# EAGLE design Risha (EAGLE 6.1)
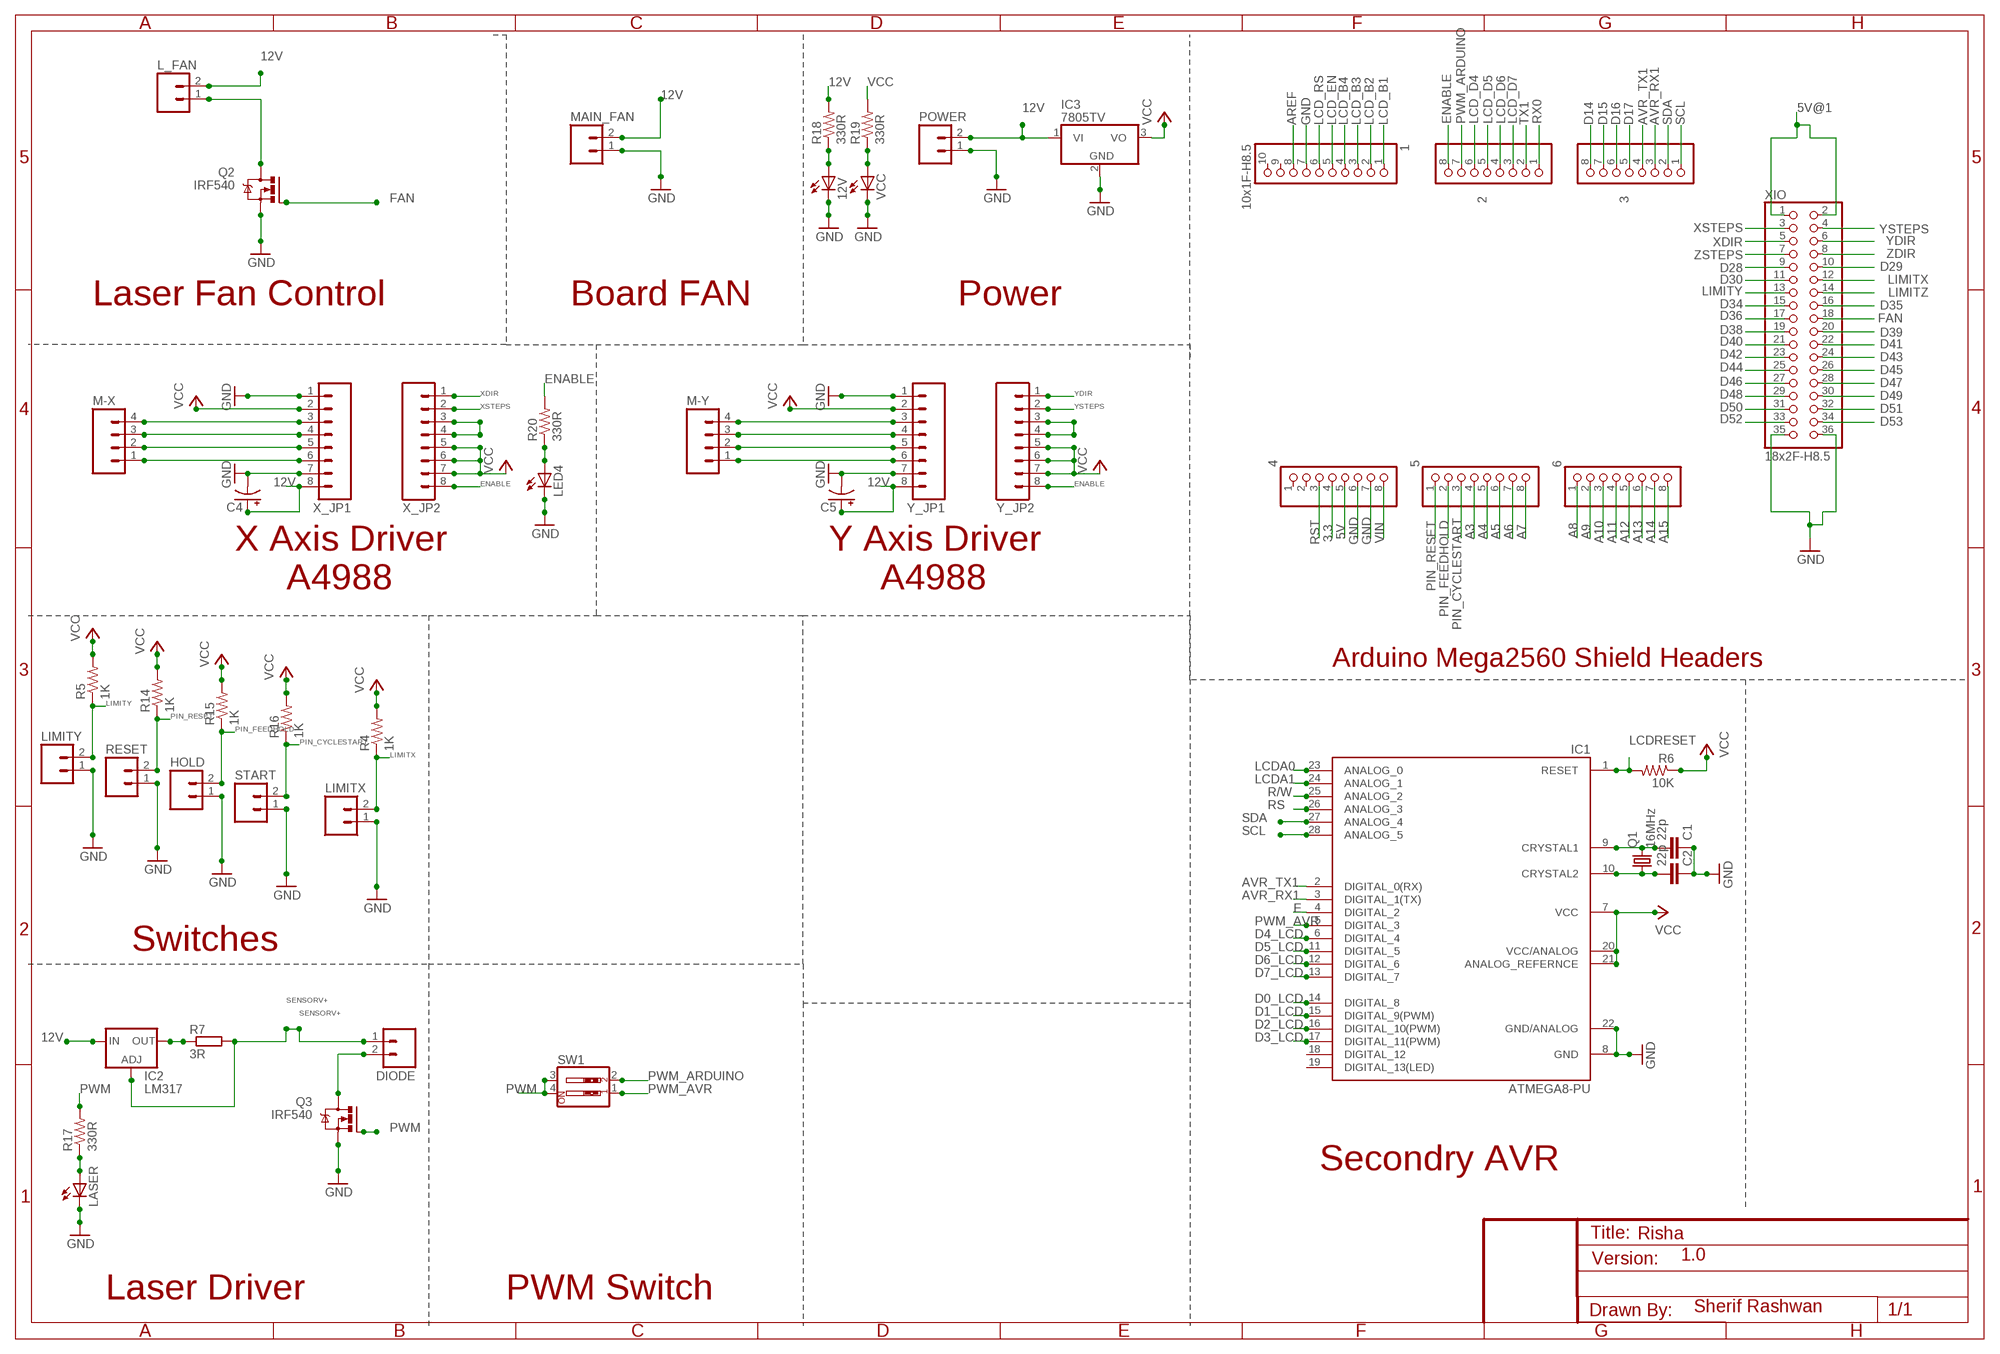
[diagram p0: schematic, sheet 1]

## Parts
1  10x1F-H8.5  PINHD-1X10_ARD  [1X10]
2  8x1F-H8.5  PINHD-1X8  [1X08]
3  8x1F-H8.5  PINHD-1X8  [1X08]
4  8x1F-H8.5  PINHD-1X8  [1X08]
5  8x1F-H8.5  PINHD-1X8  [1X08]
6  8x1F-H8.5  PINHD-1X8  [1X08]
12V  LED3MM  [LED3MM]
C1  22p  C2.5/2  [C2.5-2]
C2  22p  C2.5/2  [C2.5-2]
C4  CAP_POLPTH2  [CPOL-RADIAL-10UF-25V]
C5  CAP_POLPTH2  [CPOL-RADIAL-10UF-25V]
DIODE  M02PTH  [1X02]
HOLD  M02PTH  [1X02]
IC1  ATMEGA8-PU  [DIL28-3]
IC2  LM317  LM317-TO3  [TO3-K02]
IC3  7805TV  [TO220V]
L_FAN  M02PTH  [1X02]
LASER  LED3MM  [LED3MM]
LED4  LED3MM  [LED3MM]
LIMITX  M02PTH  [1X02]
LIMITY  M02PTH  [1X02]
M-X  M04PTH  [1X04]
M-Y  M04PTH  [1X04]
MAIN_FAN  M02PTH  [1X02]
POWER  M02PTH  [1X02]
Q1  16MHz  CRYSTALHC49US  [HC49US]
Q2  IRF540  [TO220BV]
Q3  IRF540  [TO220BV]
R4  1K  RESISTORPTH-1/6W  [1/6W-RES]
R5  1K  RESISTORPTH-1/6W  [1/6W-RES]
R6  10K  RESISTORPTH-1/6W  [1/6W-RES]
R7  3R  R-EU_0309/12  [0309/12]
R14  1K  RESISTORPTH-1/6W  [1/6W-RES]
R15  1K  RESISTORPTH-1/6W  [1/6W-RES]
R16  1K  RESISTORPTH-1/6W  [1/6W-RES]
R17  330R  RESISTORPTH-1/6W  [1/6W-RES]
R18  330R  RESISTORPTH-1/6W  [1/6W-RES]
R19  330R  RESISTORPTH-1/6W  [1/6W-RES]
R20  330R  RESISTORPTH-1/6W  [1/6W-RES]
RESET  M02PTH  [1X02]
START  M02PTH  [1X02]
SW1  SW_DIP-2  [EDG-02]
VCC  LED3MM  [LED3MM]
X_JP1  M08  [1X08]
X_JP2  M08  [1X08]
XIO  18x2F-H8.5  PINHD-2X18  [2X18]
Y_JP1  M08  [1X08]
Y_JP2  M08  [1X08]

## Nets
3.3: 4.4
5V: 4.5
5V@1: XIO.1 XIO.2
12V: C4.1(+) C5.1(+) IC2.1(IN) IC3.1(VI) L_FAN.2 MAIN_FAN.2 POWER.2 R18.2 X_JP1.8 Y_JP1.8
A3: 5.4
A4: 5.5
A5: 5.6
A6: 5.7
A7: 5.8
A8: 6.1
A9: 6.2
A10: 6.3
A11: 6.4
A12: 6.5
A13: 6.6
A14: 6.7
A15: 6.8
AREF: 1.8
AVR_RX1: 3.3 IC1.3(DIGITAL_1(TX))
AVR_TX1: 3.4 IC1.2(DIGITAL_0(RX))
D0_LCD: IC1.14(DIGITAL_8)
D1_LCD: IC1.15(DIGITAL_9(PWM))
D2_LCD: IC1.16(DIGITAL_10(PWM))
D3_LCD: IC1.17(DIGITAL_11(PWM))
D4_LCD: IC1.6(DIGITAL_4)
D5_LCD: IC1.11(DIGITAL_5)
D6_LCD: IC1.12(DIGITAL_6)
D7_LCD: IC1.13(DIGITAL_7)
D14: 3.8
D15: 3.7
D16: 3.6
D17: 3.5
D28: XIO.9
D29: XIO.10
D30: XIO.11
D34: XIO.15
D35: XIO.16
D36: XIO.17
D38: XIO.19
D39: XIO.20
D40: XIO.21
D41: XIO.22
D42: XIO.23
D43: XIO.24
D44: XIO.25
D45: XIO.26
D46: XIO.27
D47: XIO.28
D48: XIO.29
D49: XIO.30
D50: XIO.31
D51: XIO.32
D52: XIO.33
D53: XIO.34
E: IC1.4(DIGITAL_2)
ENABLE: 2.8 R20.2 X_JP2.8 Y_JP2.8
FAN: Q2.G XIO.18
GND: 1.7 4.6 4.7 12V.K(C) C1.1 C2.1 C4.2(-) C5.2(-) HOLD.1 IC1.8(GND) IC1.22(GND/ANALOG) IC3.2(GND) LASER.K(C) LED4.K(C) LIMITX.1 LIMITY.1 MAIN_FAN.1 POWER.1 Q2.S Q3.S RESET.1 START.1 VCC.K(C) X_JP1.1 X_JP1.7 XIO.35 XIO.36 Y_JP1.1 Y_JP1.7
LCD_B1: 1.1
LCD_B2: 1.2
LCD_B3: 1.3
LCD_B4: 1.4
LCD_D4: 2.6
LCD_D5: 2.5
LCD_D6: 2.4
LCD_D7: 2.3
LCD_EN: 1.5
LCD_RS: 1.6
LCDA0: IC1.23(ANALOG_0)
LCDA1: IC1.24(ANALOG_1)
LCDRESET: IC1.1(RESET) R6.2
LIMITX: LIMITX.2 R4.1 XIO.12
LIMITY: LIMITY.2 R5.1 XIO.13
LIMITZ: XIO.14
N$1: L_FAN.1 Q2.D
N$2: M-Y.4 Y_JP1.3
N$3: M-Y.3 Y_JP1.4
N$4: M-Y.2 Y_JP1.5
N$5: M-Y.1 Y_JP1.6
N$6: Y_JP2.3 Y_JP2.4
N$7: C1.2 IC1.9(CRYSTAL1) Q1.2
N$8: C2.2 IC1.10(CRYSTAL2) Q1.1
N$9: LASER.A R17.1
N$10: IC2.3(OUT) R7.1
N$11: DIODE.2 Q3.D
N$18: 12V.A R18.1
N$20: R19.1 VCC.A
N$21: LED4.A R20.1
N$28: M-X.4 X_JP1.3
N$29: M-X.3 X_JP1.4
N$30: M-X.2 X_JP1.5
N$31: M-X.1 X_JP1.6
N$35: X_JP2.3 X_JP2.4
PIN_CYCLESTART: 5.3 R16.1 START.2
PIN_FEEDHOLD: 5.2 HOLD.2 R15.1
PIN_RESET: 5.1 R14.1 RESET.2
PWM: Q3.G R17.2 SW1.3 SW1.4
PWM_ARDUINO: 2.7 SW1.2
PWM_AVR: IC1.5(DIGITAL_3) SW1.1
R/W: IC1.25(ANALOG_2)
RS: IC1.26(ANALOG_3)
RST: 4.3
RX0: 2.1
SCL: 3.1 IC1.28(ANALOG_5)
SDA: 3.2 IC1.27(ANALOG_4)
SENSORV+: DIODE.1 IC2.2(ADJ) R7.2
TX1: 2.2
VCC: IC1.7(VCC) IC1.20(VCC/ANALOG) IC1.21(ANALOG_REFERNCE) IC3.3(VO) R4.2 R5.2 R6.1 R14.2 R15.2 R16.2 R19.2 X_JP1.2 X_JP2.5 X_JP2.6 X_JP2.7 Y_JP1.2 Y_JP2.5 Y_JP2.6 Y_JP2.7
VIN: 4.8
XDIR: X_JP2.1 XIO.5
XSTEPS: X_JP2.2 XIO.3
YDIR: XIO.6 Y_JP2.1
YSTEPS: XIO.4 Y_JP2.2
ZDIR: XIO.8
ZSTEPS: XIO.7
Unconnected: 1.9 1.10 4.1 4.2 IC1.18(DIGITAL_12) IC1.19(DIGITAL_13(LED))

## Notes on the sheet
- Laser Fan Control | Board FAN | Power
- X Axis Driver | Y Axis Driver
- A4988 | A4988
- Arduino Mega2560 Shield Headers
- Switches
- Secondry AVR
- 1.0
- Laser Driver | PWM Switch
- Sherif Rashwan

## Library data of the parts
1 = SmartPrj:PINHD-1X10_ARD: PIN HEADER
2-6 = SmartPrj:PINHD-1X8: PIN HEADER
12V LASER LED4 VCC = 01_SparkFun:LED: LEDs Standard schematic elements and footprints for 5mm, 3mm, 1206, and 0603 sized LEDs. 5mm - Spark Fun Electronics SKU : COM-00529 (and others)
C1 C2 = capacitor-wima:C: CAPACITOR naming: grid - package width
C4 C5 = 01_SparkFun:CAP_POL: Capacitor Polarized These are standard SMD and PTH capacitors. Normally 10uF, 47uF, and 100uF in electrolytic and tantalum varieties. Always verify the external diameter of the through hole cap, it varies with capacity, voltage, and manufacturer. The EIA devices should be standard.
DIODE HOLD L_FAN LIMITX LIMITY MAIN_FAN POWER RESET START = 01_SparkFun:M02: Header 2 Standard 2-pin 0.1" header. Use with straight break away headers (SKU : PRT-00116), right angle break away headers (PRT-00553), swiss pins (PRT-00743), machine pins (PRT-00117), and female headers (PRT-00115). Molex polarized connector foot print use with SKU : PRT-08233 with associated crimp pins and housings.
IC1 = 01_Arduino-AVR:ATMEGA8-PU
IC2 = v-reg:LM317-TO3: VOLTAGE REGULATOR
IC3 = linear:78*: Positive VOLTAGE REGULATOR Source: http://cache.national.com/ds/LM/LM78L05.pdf http://www.fairchildsemi.com/ds/LM/LM7805.pdf
M-X M-Y = 01_SparkFun:M04: Header 4 Standard 4-pin 0.1" header. Use with straight break away headers (SKU : PRT-00116), right angle break away headers (PRT-00553), swiss pins (PRT-00743), machine pins (PRT-00117), and female headers (PRT-00115). Molex polarized connector foot print use with SKU : PRT-08231 with associated crimp pins and housings.
Q1 = 01_SparkFun:CRYSTAL: Crystals Various standard crystals. Proven footprints. Spark Fun Electronics SKU : COM-00534
Q2 Q3 = transistor-power:IRF540: HEXFET Power MOSFET
R4-R6 R14-R20 = 01_SparkFun:RESISTOR: Resistor Basic schematic elements and footprints for 0603, 1206, and PTH 1/10th watt (small) resistors.
R7 = rcl:R-EU_: RESISTOR, European symbol
SW1 = special:SW_DIP-2: DIP SWITCH
X_JP1 X_JP2 Y_JP1 Y_JP2 = 01_SparkFun:M08: Header 8 Standard 8-pin 0.1" header. Use with straight break away headers (SKU : PRT-00116), right angle break away headers (PRT-00553), swiss pins (PRT-00743), machine pins (PRT-00117), and female headers (PRT-00115).
XIO = SmartPrj:PINHD-2X18: PIN HEADER

## Board
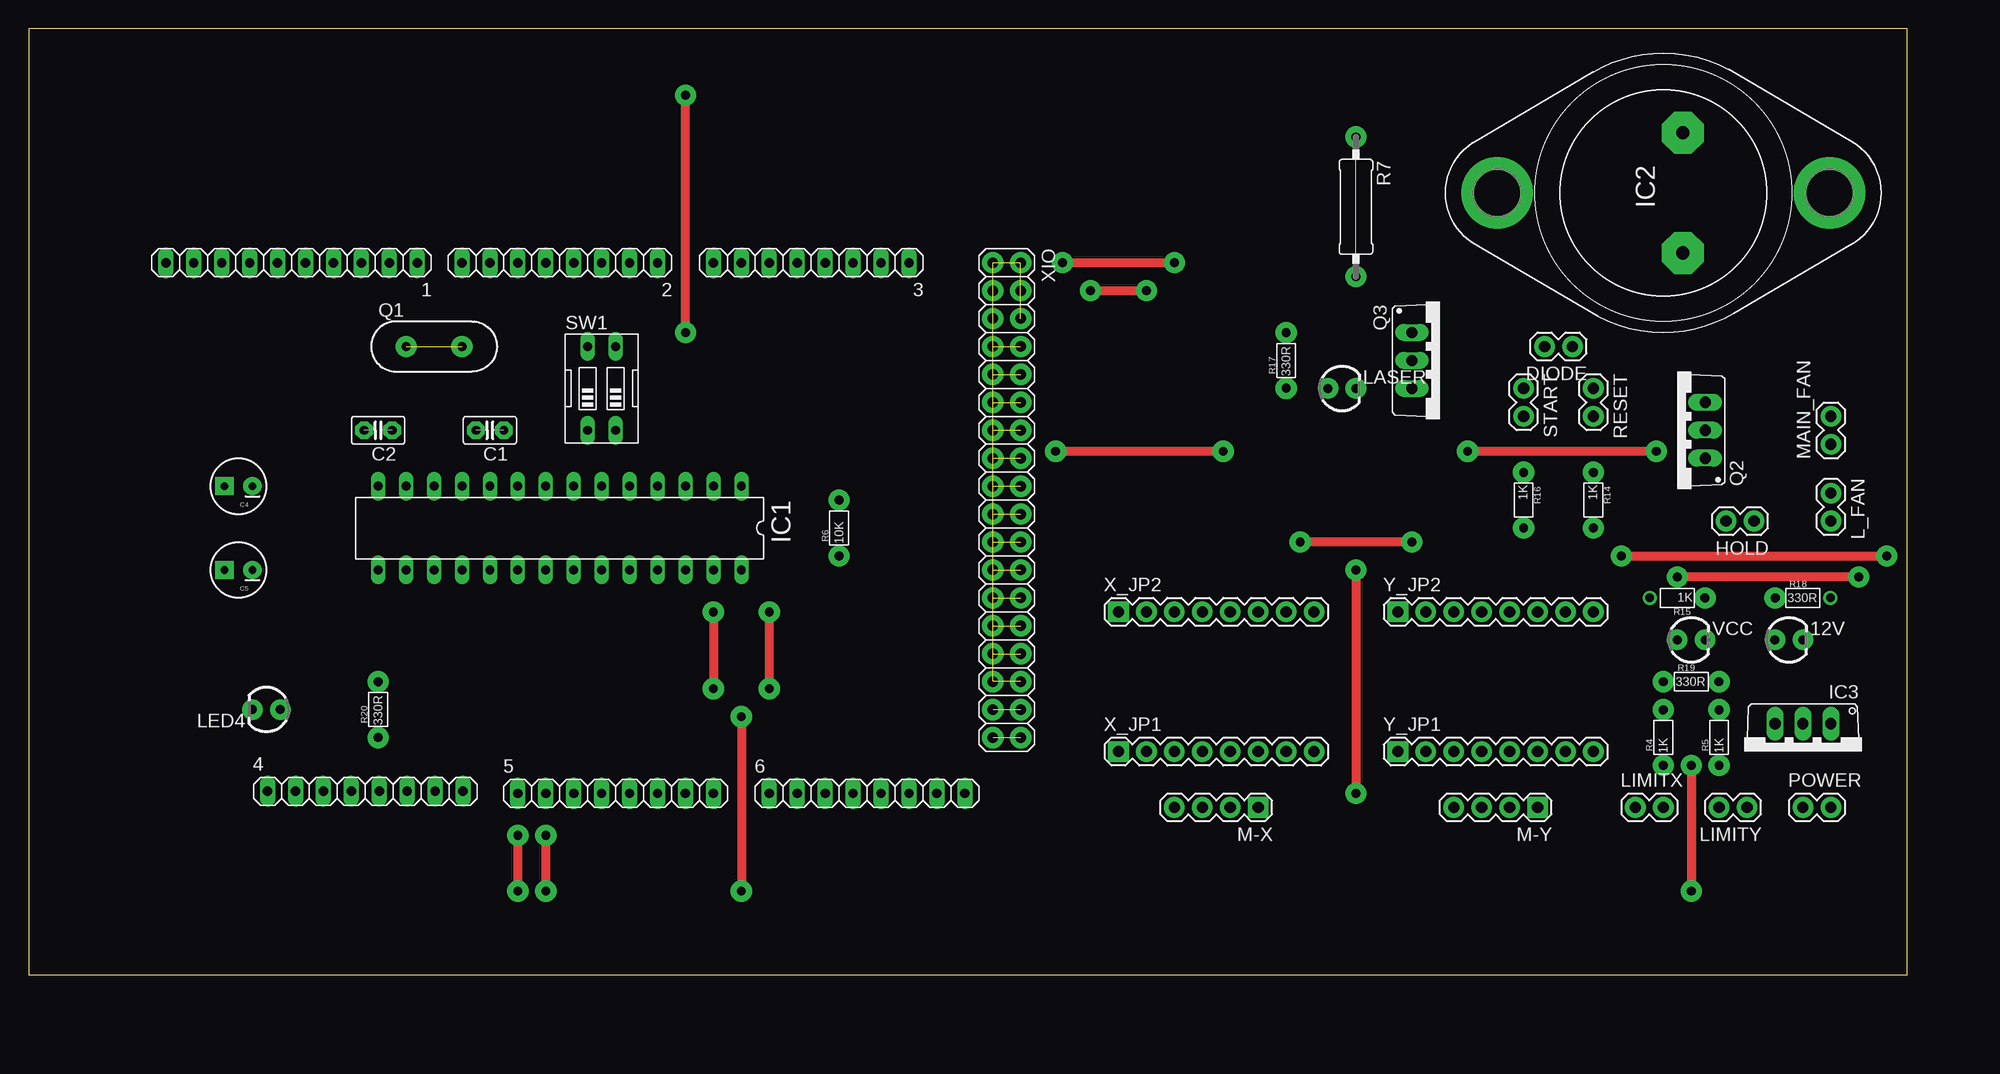
[diagram p1: board, top side]
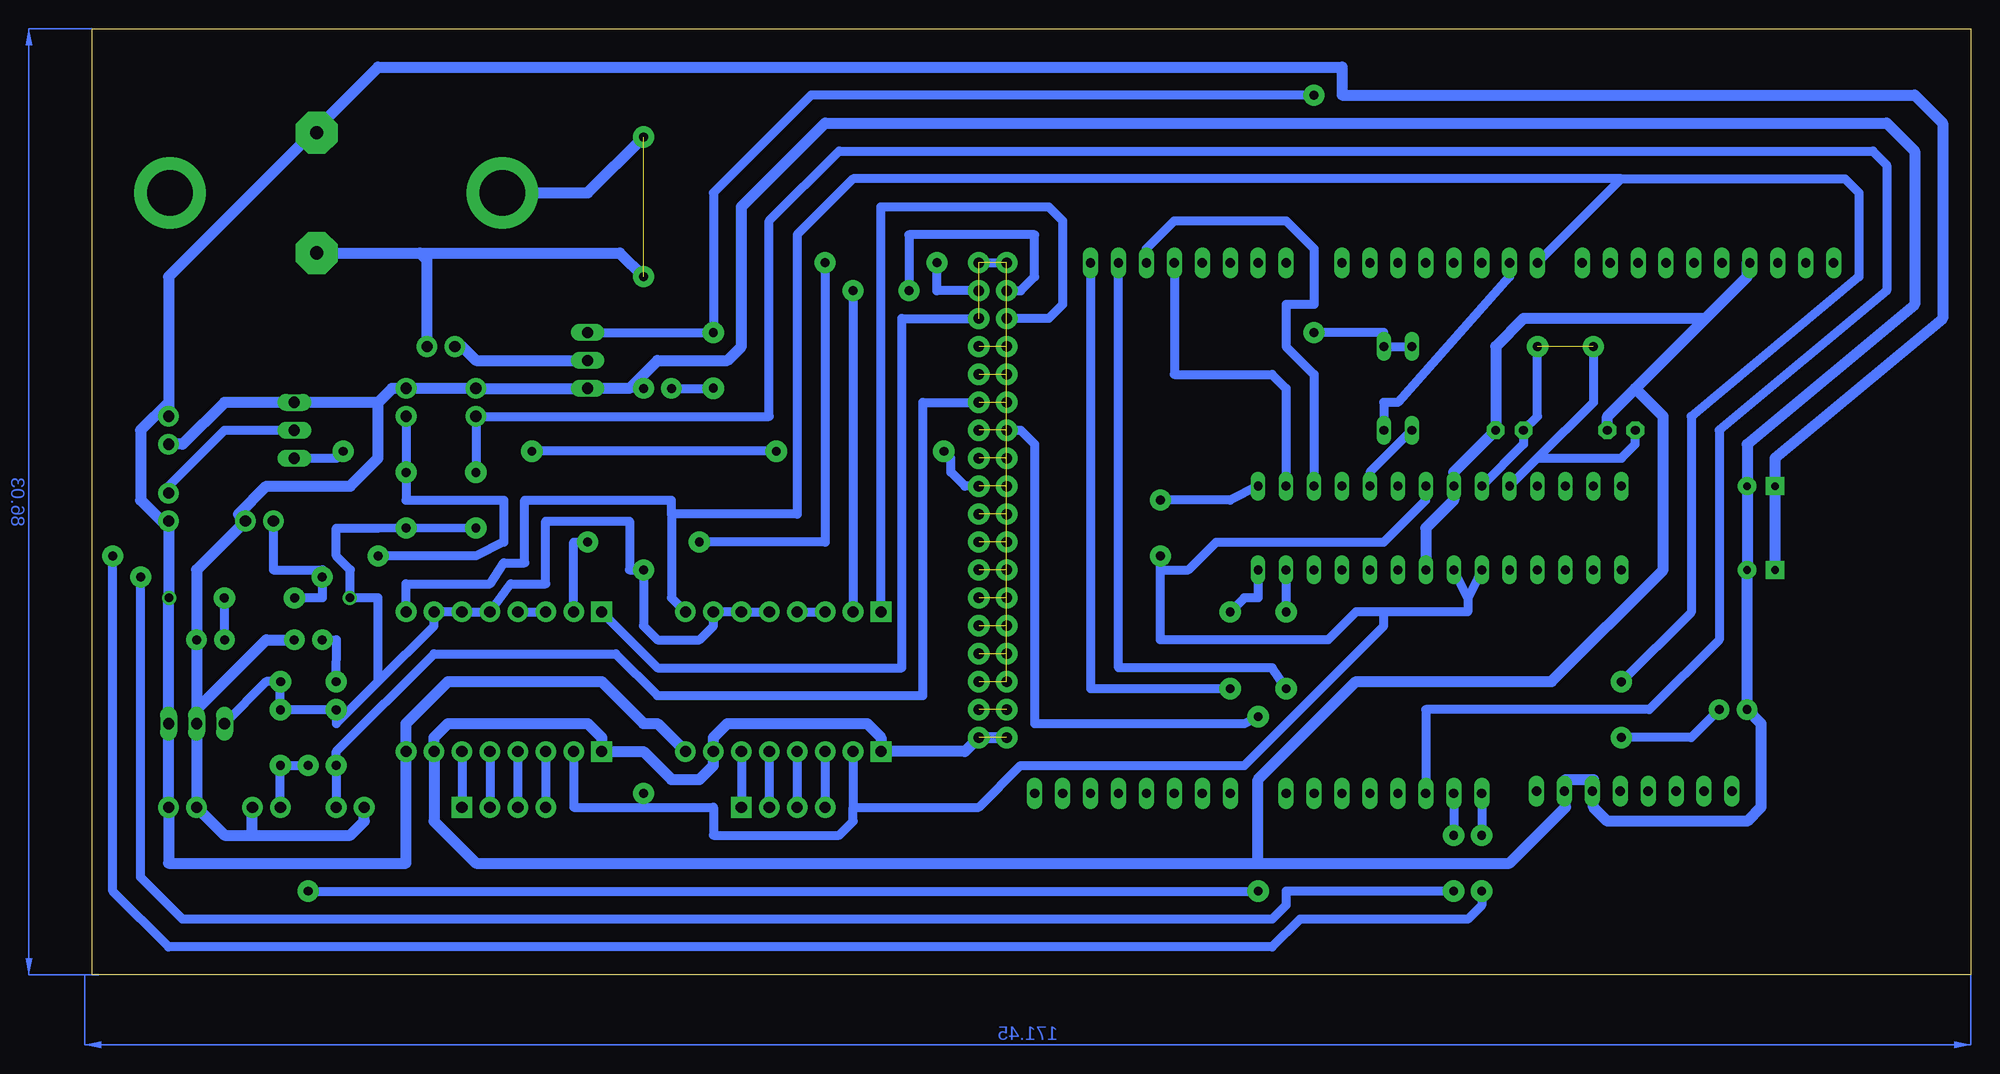
[diagram p2: board, bottom side, seen from below]

Size 170.8 x 86.03 mm. Coordinates in mm from the lower left corner, seen from the top.
Outline: 0,0 170.8,0 170.8,86.03 0,86.03 0,0
Copper layers (1*16): Top 0.035mm / dielectric 1.5mm / Bottom 0.035mm
Design rules: minimum track width 1mm, minimum drill 24mil, track to track 0.8mm, track to pad 0.8mm, pad to pad 8mil, via to via 8mil, smd to smd 8mil, copper to edge 40mil, drill to drill 8mil, minimum pad ring 10mil, minimum via ring 8mil, stop-mask expansion 4mil, vias tented up to drill 0mil, thermal gap 10mil

### Footprints (pad centres in the part's own frame; a part is rotated, then mirrored left to right if it is on the bottom)
1X10 = drill 0.85 pad 1.422 long: 1 -11.43,0; 2 -8.89,0; 3 -6.35,0; 4 -3.81,0; 5 -1.27,0; 6 1.27,0; 7 3.81,0; 8 6.35,0; 9 8.89,0; 10 11.43,0
1X08 = drill 0.85 pad 1.422 long: 1 -8.89,0; 2 -6.35,0; 3 -3.81,0; 4 -1.27,0; 5 1.27,0; 6 3.81,0; 7 6.35,0; 8 8.89,0
LED3MM = drill 0.813 pad 1.88: A -1.27,0; K 1.27,0
C2.5-2 = drill 0.813 pad 1.6 octagon: 1 -1.27,0; 2 1.27,0
CPOL-RADIAL-10UF-25V = drill 0.7 pad 1.651 square: 1 1.27,0 | drill 0.7 pad 1.651: 2 -1.27,0
1X02 = drill 1.016 pad 1.88: 1 0,0; 2 2.54,0
DIL28-3 = drill 0.813 long: 1 -16.51,-3.81; 2 -13.97,-3.81; 3 -11.43,-3.81; 4 -8.89,-3.81; 5 -6.35,-3.81; 6 -3.81,-3.81; 7 -1.27,-3.81; 8 1.27,-3.81; 9 3.81,-3.81; 10 6.35,-3.81; 11 8.89,-3.81; 12 11.43,-3.81; 13 13.97,-3.81; 14 16.51,-3.81; 15 16.51,3.81; 16 13.97,3.81; 17 11.43,3.81; 18 8.89,3.81; 19 6.35,3.81; 20 3.81,3.81; 21 1.27,3.81; 22 -1.27,3.81; 23 -3.81,3.81; 24 -6.35,3.81; 25 -8.89,3.81; 26 -11.43,3.81; 27 -13.97,3.81; 28 -16.51,3.81
TO3-K02 = drill 1.194 pad 3.81 octagon: 1 -1.778,-5.461; 2 -1.778,5.461 | drill 4.115 pad 6.477: 3 15.113,0; 3@ -15.113,0
TO220V = drill 1.016 long: 1 -2.54,-2.54; 2 0,-2.54; 3 2.54,-2.54
1X04 = drill 1.016 pad 1.88 square: 1 0,0 | drill 1.016 pad 1.88: 2 2.54,0; 3 5.08,0; 4 7.62,0
HC49US = drill 0.813: 1 -2.54,0; 2 2.54,0
TO220BV = drill 1.016 long: D 0,-2.54; G -2.54,-2.54; S 2.54,-2.54
1/6W-RES = drill 0.762: 1 -2.5,0; 2 2.5,0
0309/12 = drill 0.813 octagon: 1 -6.35,0; 2 6.35,0
EDG-02 = drill 0.813 long: 1 -1.27,-3.81; 2 1.27,-3.81; 3 1.27,3.81; 4 -1.27,3.81
1X08' = drill 1.016 pad 1.88 square: 1 0,0 | drill 1.016 pad 1.88: 2 2.54,0; 3 5.08,0; 4 7.62,0; 5 10.16,0; 6 12.7,0; 7 15.24,0; 8 17.78,0
2X18 = drill 0.95 pad 1.676 octagon: 1 -21.59,-1.27; 2 -21.59,1.27; 3 -19.05,-1.27; 4 -19.05,1.27; 5 -16.51,-1.27; 6 -16.51,1.27; 7 -13.97,-1.27; 8 -13.97,1.27; 9 -11.43,-1.27; 10 -11.43,1.27; 11 -8.89,-1.27; 12 -8.89,1.27; 13 -6.35,-1.27; 14 -6.35,1.27; 15 -3.81,-1.27; 16 -3.81,1.27; 17 -1.27,-1.27; 18 -1.27,1.27; 19 1.27,-1.27; 20 1.27,1.27; 21 3.81,-1.27; 22 3.81,1.27; 23 6.35,-1.27; 24 6.35,1.27; 25 8.89,-1.27; 26 8.89,1.27; 27 11.43,-1.27; 28 11.43,1.27; 29 13.97,-1.27; 30 13.97,1.27; 31 16.51,-1.27; 32 16.51,1.27; 33 19.05,-1.27; 34 19.05,1.27; 35 21.59,-1.27; 36 21.59,1.27

### Placement (x,y rotation side)
1  23.88,64.77 180 top
2  48.26,64.77 180 top
3  71.12,64.77 180 top
4  30.58,16.71 0 top
5  53.34,16.51 0 top
6  76.2,16.51 0 top
12V  160.02,30.48 0 top
C1  41.91,49.53 180 top
C2  31.75,49.53 180 top
C4  19.05,44.45 180 top
C5  19.05,36.83 180 top
DIODE  140.34,57.15 180 top
HOLD  156.84,41.27 180 top
IC1  48.26,40.64 180 top
IC2  148.59,71.12 180 top
IC3  161.29,20.32 180 top
L_FAN  163.83,43.81 270 top
LASER  119.38,53.34 0 top
LED4  21.59,24.13 180 top
LIMITX  146.05,15.24 0 top
LIMITY  156.21,15.24 180 top
M-X  111.76,15.24 180 top
M-Y  137.16,15.24 180 top
MAIN_FAN  163.83,48.26 90 top
POWER  161.29,15.24 0 top
Q1  36.83,57.15 0 top
Q2  149.86,49.53 90 top
Q3  128.27,55.88 270 top
R4  148.59,21.59 90 top
R5  153.67,21.59 90 top
R6  73.66,40.64 90 top
R7  120.65,69.85 270 top
R14  142.24,43.18 270 top
R15  149.86,34.29 180 top
R16  135.89,43.18 270 top
R17  114.3,55.88 90 top
R18  161.29,34.29 0 top
R19  151.13,26.67 0 top
R20  31.75,24.13 90 top
RESET  142.24,53.34 270 top
START  135.89,53.34 270 top
SW1  52.07,53.34 0 top
VCC  151.13,30.48 0 top
X_JP1  [1X08']  99.06,20.32 0 top
X_JP2  [1X08']  99.06,33.02 0 top
XIO  88.9,43.18 270 top
Y_JP1  [1X08']  124.46,20.32 0 top
Y_JP2  [1X08']  124.46,33.02 0 top

### Tracks (layer width: path | path; a pad name or v marks a point on that pad's centre or on a via)
5V@1
  Bottom 0.8: XIO.2 XIO.1
12V
  Bottom 1: X_JP1.8 119.38,22.86 120.65,22.86 124.46,26.67 138.43,26.67 142.24,22.86 Y_JP1.8 142.24,10.16 163.83,10.16 POWER.2 IC3.1 163.83,34.29 | 163.83,40.64 163.83,34.29 | 163.83,34.29 R18.2 | 163.83,52.07 163.83,63.5 151.13,76.2 IC2.1 149.86,77.47 144.78,82.55 57.15,82.55 57.15,80.01 5.08,80.01 2.54,77.47 2.54,59.69 17.78,46.99 C4.1 C5.1 | 163.83,52.07 MAIN_FAN.2 | 163.83,40.64 166.37,43.18 166.37,49.53 163.83,52.07 | 163.83,40.64 L_FAN.2
AVR_RX1
  Bottom 0.8: IC1.3 59.69,54.61 62.23,57.15 62.23,60.96 59.69,60.96 59.69,66.04 62.23,68.58 72.39,68.58 74.93,66.04 3.3
AVR_TX1
  Bottom 0.8: IC1.2 62.23,53.34 63.5,54.61 72.39,54.61 3.4
ENABLE
  Bottom 0.8: Y_JP2.8 142.24,35.56 134.62,35.56 133.35,37.47 131.44,37.47 131.44,43.18 118.11,43.18 118.11,41.91 | 2.8 31.75,72.39 | 31.75,72.39 11.43,72.39 10.16,71.12 10.16,63.5 25.4,50.8 25.4,32.98 R20.2 | 118.11,41.91 106.68,41.91 106.68,67.31 101.6,72.39 31.75,72.39 | 118.11,41.91 118.11,34.29 X_JP2.8
FAN  (via drill 0.8 pad 1.93)
  Top 0.8: v93.34,47.62 v108.59,47.62 | v130.81,47.62 v147.96,47.62
  Bottom 0.8: v108.59,47.62 v130.81,47.62 | Q2.G 148.59,46.99 v147.96,47.62 | XIO.18 91.44,44.45 92.71,45.72 92.71,46.99 v93.34,47.62
GND
  Bottom 0.8: LASER.K 121.92,53.34
  Bottom 1: LIMITX.1 146.05,13.97 147.32,12.7 156.21,12.7 | 156.21,12.7 158.75,12.7 POWER.1 IC3.2 161.29,24.13 | 156.21,12.7 LIMITY.1 | 30.48,53.34 33.02,50.8 C2.1 | 30.48,53.34 24.13,59.69 | 24.13,59.69 20.32,63.5 20.32,64.77 1.7 | 24.13,59.69 40.64,59.69 43.18,57.15 C1.1 46.99,45.72 IC1.8 46.99,43.18 49.53,40.64 IC1.22 | 64.77,10.16 135.89,10.16 139.7,13.97 Y_JP1.7 139.7,21.59 138.43,22.86 125.73,22.86 124.46,21.59 Y_JP1.1 120.65,20.32 118.11,17.78 115.57,17.78 114.3,19.05 X_JP1.7 114.3,21.59 113.03,22.86 100.33,22.86 99.06,21.59 X_JP1.1 91.44,20.32 XIO.36 XIO.35 | 64.77,10.16 41.91,10.16 36.83,15.24 36.83,16.51 4.7 36.83,17.78 34.29,17.78 4.6 34.29,16.51 34.29,15.24 33.02,13.97 20.32,13.97 19.05,15.24 19.05,22.86 LED4.K C5.2 C4.2 20.32,48.26 5.08,60.96 5.08,74.93 7.62,77.47 104.14,77.47 111.76,69.85 111.76,57.15 113.03,55.88 119.38,55.88 121.92,53.34 Q3.S START.1 RESET.1 143.51,53.34 144.78,52.07 | 30.48,53.34 27.94,50.8 27.94,36.83 38.1,26.67 55.88,26.67 64.77,17.78 64.77,10.16 | 144.78,52.07 Q2.S 158.75,52.07 162.56,48.26 MAIN_FAN.1 | 144.78,52.07 144.78,46.99 147.32,44.45 154.94,44.45 157.48,41.91 HOLD.1 161.29,36.83 12V.K 161.29,24.13 | VCC.K 154.94,30.48 161.29,24.13
LCDRESET  (via drill 0.8 pad 1.93)
  Bottom 0.8: IC1.1 67.31,43.18 v73.66,43.18 R6.2
LIMITX  (via drill 0.8 pad 1.93)
  Bottom 0.8: XIO.12 95.25,52.07 95.25,25.4 119.38,25.4 123.19,29.21 139.7,29.21 148.59,20.32 v148.59,19.05 | v148.59,19.05 LIMITX.2 | R4.1 v148.59,19.05
LIMITY  (via drill 0.8 pad 1.93)
  Top 0.8: v151.13,19.05 v151.13,7.62 | v64.77,23.5 v64.77,7.62
  Bottom 0.8: LIMITY.2 v153.67,19.05 | XIO.13 86.36,49.53 85.09,48.26 85.09,22.86 66.04,22.86 v64.77,23.5 | R5.1 v153.67,19.05 | v153.67,19.05 v151.13,19.05 | v151.13,7.62 v64.77,7.62
N$1
  Bottom 0.8: Q2.D 158.75,49.53 163.83,44.45 L_FAN.1
N$2
  Bottom 0.8: Y_JP1.3 M-Y.4
N$3
  Bottom 0.8: Y_JP1.4 M-Y.3
N$4
  Bottom 0.8: Y_JP1.5 M-Y.2
N$5
  Bottom 0.8: Y_JP1.6 M-Y.1
N$6
  Bottom 0.8: Y_JP2.4 Y_JP2.3
N$7
  Bottom 0.8: IC1.9 40.64,48.26 C1.2 39.37,50.8 Q1.2
N$8
  Bottom 0.8: 39.37,46.99 34.29,52.07 Q1.1 | 39.37,46.99 IC1.10 | C2.2 30.48,48.26 31.75,46.99 39.37,46.99
N$9  (via drill 0.8 pad 1.93)
  Bottom 0.8: LASER.A v114.3,53.34 R17.1
N$10
  Bottom 1: IC2.3 125.73,71.12 R7.1
N$11
  Bottom 1: Q3.D 135.89,55.88 137.16,57.15 DIODE.2
N$12  (via drill 0.8 pad 1.93)
  other vias: 135.89,40.64
N$13  (via drill 0.8 pad 1.93)
  other vias: 142.24,40.64
N$14  (via drill 0.8 pad 1.93)
  other vias: 152.4,34.29
N$15  (via drill 0.8 pad 1.93)
  other vias: 148.59,26.67
N$16  (via drill 0.8 pad 1.93)
  other vias: 31.75,21.59
N$17  (via drill 0.8 pad 1.93)
  other vias: 31.75,26.67
N$18  (via drill 0.8 pad 1.93)
  Bottom 0.8: R18.1 v158.75,34.29 12V.A
N$19  (via drill 0.8 pad 1.93)  (1 unrouted)
  other vias: 39.37,57.15 39.37,57.15 39.37,57.15 39.37,57.15 34.29,57.15
N$20
  Bottom 0.8: VCC.A 148.59,30.48 R19.1
N$21
  Bottom 0.8: LED4.A 25.4,21.59 31.71,21.59 R20.1
N$22  (via drill 0.8 pad 1.93)  (1 unrouted)
  other vias: 120.65,63.5 120.65,76.2
N$23  (via drill 0.8 pad 1.93)  (8 unrouted)
  other vias: 87.63,26.67 87.63,64.77 90.17,64.77 87.63,62.23 90.17,62.23 87.63,59.69 90.17,59.69 87.63,57.15 90.17,26.67
N$24  (via drill 0.8 pad 1.93)  (1 unrouted)
  other vias: 87.63,57.15 90.17,57.15
N$25  (via drill 0.8 pad 1.93)  (1 unrouted)
  other vias: 87.63,54.61 90.17,54.61
N$26  (via drill 0.8 pad 1.93)  (1 unrouted)
  other vias: 87.63,52.07 90.17,52.07
N$27  (via drill 0.8 pad 1.93)  (1 unrouted)
  other vias: 87.63,49.53 90.17,49.53
N$28
  Bottom 0.8: X_JP1.3 M-X.4
N$29
  Bottom 0.8: X_JP1.4 M-X.3
N$30
  Bottom 0.8: X_JP1.5 M-X.2
N$31
  Bottom 0.8: X_JP1.6 M-X.1
N$32  (via drill 0.8 pad 1.93)  (1 unrouted)
  other vias: 87.63,46.99 90.17,46.99
N$33  (via drill 0.8 pad 1.93)  (1 unrouted)
  other vias: 87.63,44.45 90.17,44.45
N$34  (via drill 0.8 pad 1.93)  (1 unrouted)
  other vias: 87.63,24.13 90.17,24.13
N$35
  Bottom 0.8: X_JP2.4 X_JP2.3
N$37  (via drill 0.8 pad 1.93)  (1 unrouted)
  other vias: 87.63,41.91 90.17,41.91
N$38  (via drill 0.8 pad 1.93)  (1 unrouted)
  other vias: 87.63,39.37 90.17,39.37
N$39  (via drill 0.8 pad 1.93)  (1 unrouted)
  other vias: 87.63,36.83 90.17,36.83
N$40  (via drill 0.8 pad 1.93)  (1 unrouted)
  other vias: 87.63,34.29 90.17,34.29
N$41  (via drill 0.8 pad 1.93)  (1 unrouted)
  other vias: 87.63,31.75 90.17,31.75
N$42  (via drill 0.8 pad 1.93)  (1 unrouted)
  other vias: 87.63,29.21 90.17,29.21
N$43  (via drill 0.8 pad 1.93)  (1 unrouted)
  other vias: 90.17,21.59 87.63,21.59
PIN_CYCLESTART  (via drill 0.8 pad 1.93)
  Bottom 0.8: R16.1 v135.89,45.72 START.2 109.22,50.8 109.22,68.58 102.87,74.93 8.89,74.93 7.62,73.66 7.62,62.23 22.86,49.53 22.86,30.48 29.21,24.13 49.53,24.13 5.3
PIN_FEEDHOLD  (via drill 0.8 pad 1.93)
  Top 0.8: v46.99,12.7 v46.99,7.62 | v166.37,36.2 v149.86,36.2
  Bottom 0.8: HOLD.2 154.31,36.83 149.86,36.83 v149.86,36.2 149.86,34.29 R15.1 | 5.2 v46.99,12.7 | v46.99,7.62 62.23,7.62 62.23,6.35 63.5,5.08 162.56,5.08 166.37,8.89 v166.37,36.2
PIN_RESET  (via drill 0.8 pad 1.93)
  Top 0.8: v44.45,12.7 v44.45,7.62 | v144.78,38.1 v168.91,38.1
  Bottom 0.8: RESET.2 v142.24,45.72 R14.1 142.24,43.18 133.35,43.18 133.35,39.37 135.89,38.1 v144.78,38.1 | 5.1 v44.45,12.7 | v44.45,7.62 44.45,6.35 45.72,5.08 60.96,5.08 63.5,2.54 163.83,2.54 168.91,7.62 v168.91,38.1
PWM  (via drill 0.8 pad 1.93)
  Top 0.8: v59.69,58.42 v59.69,80.01
  Bottom 0.8: SW1.4 SW1.3 53.34,58.42 v59.69,58.42 | Q3.G v114.3,58.42 | v114.3,58.42 R17.2 | v59.69,80.01 105.41,80.01 114.3,71.12 v114.3,58.42
PWM_ARDUINO
  Bottom 0.8: SW1.2 53.34,52.07 52.07,52.07 41.91,63.5 2.7
PWM_AVR
  Bottom 0.8: IC1.5 54.61,45.72 SW1.1
SCL  (via drill 0.8 pad 1.93)
  Top 0.8: v67.31,33.02 v67.31,26.04
  Bottom 0.8: 3.1 80.01,26.04 v67.31,26.04 | IC1.28 64.77,34.29 66.04,34.29 v67.31,33.02
SDA  (via drill 0.8 pad 1.93)
  Top 0.8: v62.23,33.02 v62.23,26.04
  Bottom 0.8: IC1.27 v62.23,33.02 | v62.23,26.04 63.5,27.94 77.47,27.94 3.2
SENSORV+
  Bottom 1: IC2.2 140.97,65.66 | 140.97,65.66 122.81,65.66 R7.2 | DIODE.1 140.34,65.02 140.97,65.66
VCC  (via drill 0.8 pad 1.93)
  Top 0.8: v120.65,36.83 v120.65,16.51
  Bottom 0.8: 53.34,33.02 45.72,33.02 45.72,34.29 | IC1.20 45.72,34.29 | 45.72,34.29 IC1.21 | IC1.7 49.53,43.18 53.34,39.37 68.58,39.37 71.12,36.83 73.66,36.83 | 101.6,15.24 101.6,13.97 102.87,12.7 114.3,12.7 114.3,15.24 120.65,15.24 | 120.65,15.24 127,15.24 Y_JP1.2 | v120.65,16.51 120.65,15.24 | 53.34,33.02 53.34,31.75 66.04,19.05 86.36,19.05 90.17,15.24 101.6,15.24 | X_JP1.2 101.6,15.24 | X_JP2.5 X_JP2.6 X_JP2.7 114.3,31.75 115.57,30.48 119.38,30.48 120.65,31.75 v120.65,36.83 121.92,36.83 121.92,41.27 129.54,41.27 129.54,35.56 132.72,35.56 Y_JP2.5 Y_JP2.6 Y_JP2.7 139.7,31.75 144.78,26.67 | 73.66,36.83 v73.66,38.1 R6.1 | 147.32,34.29 147.32,36.83 148.59,38.1 148.59,40.64 144.78,40.64 | 144.78,40.64 R16.2 | 147.32,34.29 144.78,34.29 144.78,26.67 | 147.32,34.29 R15.2 | 144.78,40.64 R14.2 | v153.67,24.13 v148.59,24.13 R4.2 148.59,22.86 144.78,26.67 | v153.67,24.13 R5.2 | v153.67,24.13 v153.67,26.67 | v153.67,26.67 154.94,26.67 IC3.3 | v153.67,26.67 R19.2 | 53.34,33.02 55.88,33.02 58.42,30.48 73.66,30.48 73.66,36.83
XDIR
  Bottom 0.8: XIO.5 83.82,59.69 82.55,60.96 82.55,68.58 83.82,69.85 99.06,69.85 X_JP2.1
XSTEPS  (via drill 0.8 pad 1.93)
  Top 0.8: v96.52,62.23 v101.6,62.23
  Bottom 0.8: XIO.3 86.36,62.23 85.09,63.5 85.09,67.31 96.52,67.31 v96.52,62.23 | v101.6,62.23 X_JP2.2
YDIR
  Bottom 0.8: XIO.6 97.16,59.69 97.16,27.94 119.38,27.94 Y_JP2.1
YSTEPS  (via drill 0.8 pad 1.93)
  Top 0.8: v93.98,64.77 v104.14,64.77 | v125.73,39.37 v115.57,39.37
  Bottom 0.8: XIO.4 93.98,62.23 v93.98,64.77 | Y_JP2.2 127,39.37 v125.73,39.37 | v104.14,64.77 104.14,39.37 v115.57,39.37
(copper drawn outside any net)
  shapes: Bottom area x2